# EAGLE design Trilife_1 (EAGLE 6.1)
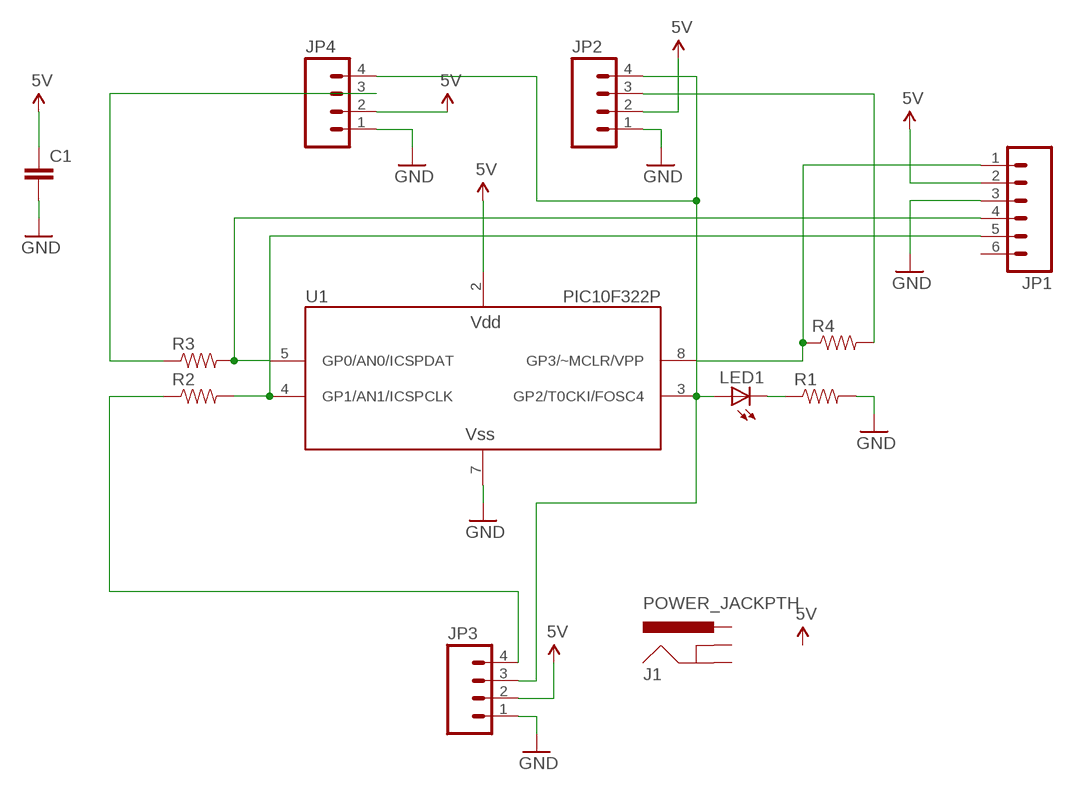
[diagram p0: schematic, sheet 1]

## Parts
C1  CAPPTH  [CAP-PTH-SMALL]
J1  POWER_JACKPTH  [POWER_JACK_PTH]
JP1  M06LOCK  [1X06_LOCK]
JP2  M04LOCK  [1X04_LOCK]
JP3  M04LOCK  [1X04_LOCK]
JP4  M04LOCK  [1X04_LOCK]
LED1  LED5MM  [LED5MM]
R1  RESISTORPTH-1/4W  [AXIAL-0.4]
R2  RESISTORPTH-1/4W  [AXIAL-0.4]
R3  RESISTORPTH-1/4W  [AXIAL-0.4]
R4  RESISTORPTH-1/4W  [AXIAL-0.4]
U1  PIC10F322P  [DIP-8]

## Nets
5V: C1.1 JP1.2 JP2.2 JP3.2 JP4.2 U1.2(VDD)
GND: C1.2 JP1.3 JP2.1 JP3.1 JP4.1 R1.P$2 U1.7(VSS)
N$1: JP2.4 JP3.3 JP4.4 LED1.A U1.3(GP2/T0CKI/FOSC4)
N$2: LED1.K(C) R1.P$1
N$3: JP1.1 R4.P$1 U1.8(GP3/~MCLR/VPP)
N$4: JP1.4 R3.P$2 U1.5(GP0/AN0/ICSPDAT)
N$5: JP1.5 R2.P$2 U1.4(GP1/AN1/ICSPCLK)
N$6: JP2.3 R4.P$2
N$8: JP4.3 R3.P$1
N$9: JP3.4 R2.P$1
Unconnected: J1.GND J1.GNDBREAK J1.PWR JP1.6

## Library data of the parts
C1 = SparkFun:CAP: Capacitor Standard 0603 ceramic capacitor, and 0.1" leaded capacitor.
J1 = SparkFun:POWER_JACK: Power Jack This is the standard 5.5mm barrel jack for power. The PTH is the most common, proven, reliable, footprint. All others are experimental. The Slot footprint only works if the mill layer is transmitted to the PCB fab house so be warned. Spark Fun Electronics SKU : PRT-00119. Mating wall wart : TOL-00298 (and others)
JP1 = SparkFun:M06: Header 6 Standard 6-pin 0.1" header. Use with straight break away headers (SKU : PRT-00116), right angle break away headers (PRT-00553), swiss pins (PRT-00743), machine pins (PRT-00117), and female headers (PRT-00115). Molex polarized connector foot print use with SKU : PRT-08094 with associated crimp pins and housings. NOTES ON THE VARIANTS LOCK and LOCK_LONGPADS... This footprint was designed to help hold the alignment of a through-hole component (i.e. 6-pin header) while soldering it into place. You may notice that each hole has been shifted either up or down by 0.005 of an inch from it's more standard position (which is a perfectly straight line). This slight alteration caused the pins (the squares in the middle) to touch the edges of the holes. Because they are alternating, it causes a "brace" to hold the component in place. 0.005 has proven to be the perfect amount of "off-center" position when using our standard breakaway headers. Although looks a little odd when you look at the bare footprint, once you have a header in there, the alteration is very hard to notice. Also, if you push a header all the way into place, it is covered up entirely on the bottom side. This idea of altering the position of holes to aid alignment will be further integrated into the Sparkfun Library for other footprints. It can help hold any component with 3 or more connection pins.
JP2-JP4 = SparkFun:M04: Header 4 Standard 4-pin 0.1" header. Use with straight break away headers (SKU : PRT-00116), right angle break away headers (PRT-00553), swiss pins (PRT-00743), machine pins (PRT-00117), and female headers (PRT-00115). Molex polarized connector foot print use with SKU : PRT-08231 with associated crimp pins and housings. 1MM SMD Version SKU: PRT-10208
LED1 = SparkFun:LED: LEDs Standard schematic elements and footprints for 5mm, 3mm, 1206, and 0603 sized LEDs. 5mm - Spark Fun Electronics SKU : COM-00529 (and others)
R1-R4 = SparkFun:RESISTOR: Resistor Basic schematic elements and footprints for 0603, 1206, and PTH resistors.
U1 = CindysStuff:PIC10F32*: Microchip PIC10F320 and 322 6-pin 8-bit Flash microcontroller 4 I/O, 2 8-bit timers, temperature sensor on PIC10F322

## Board
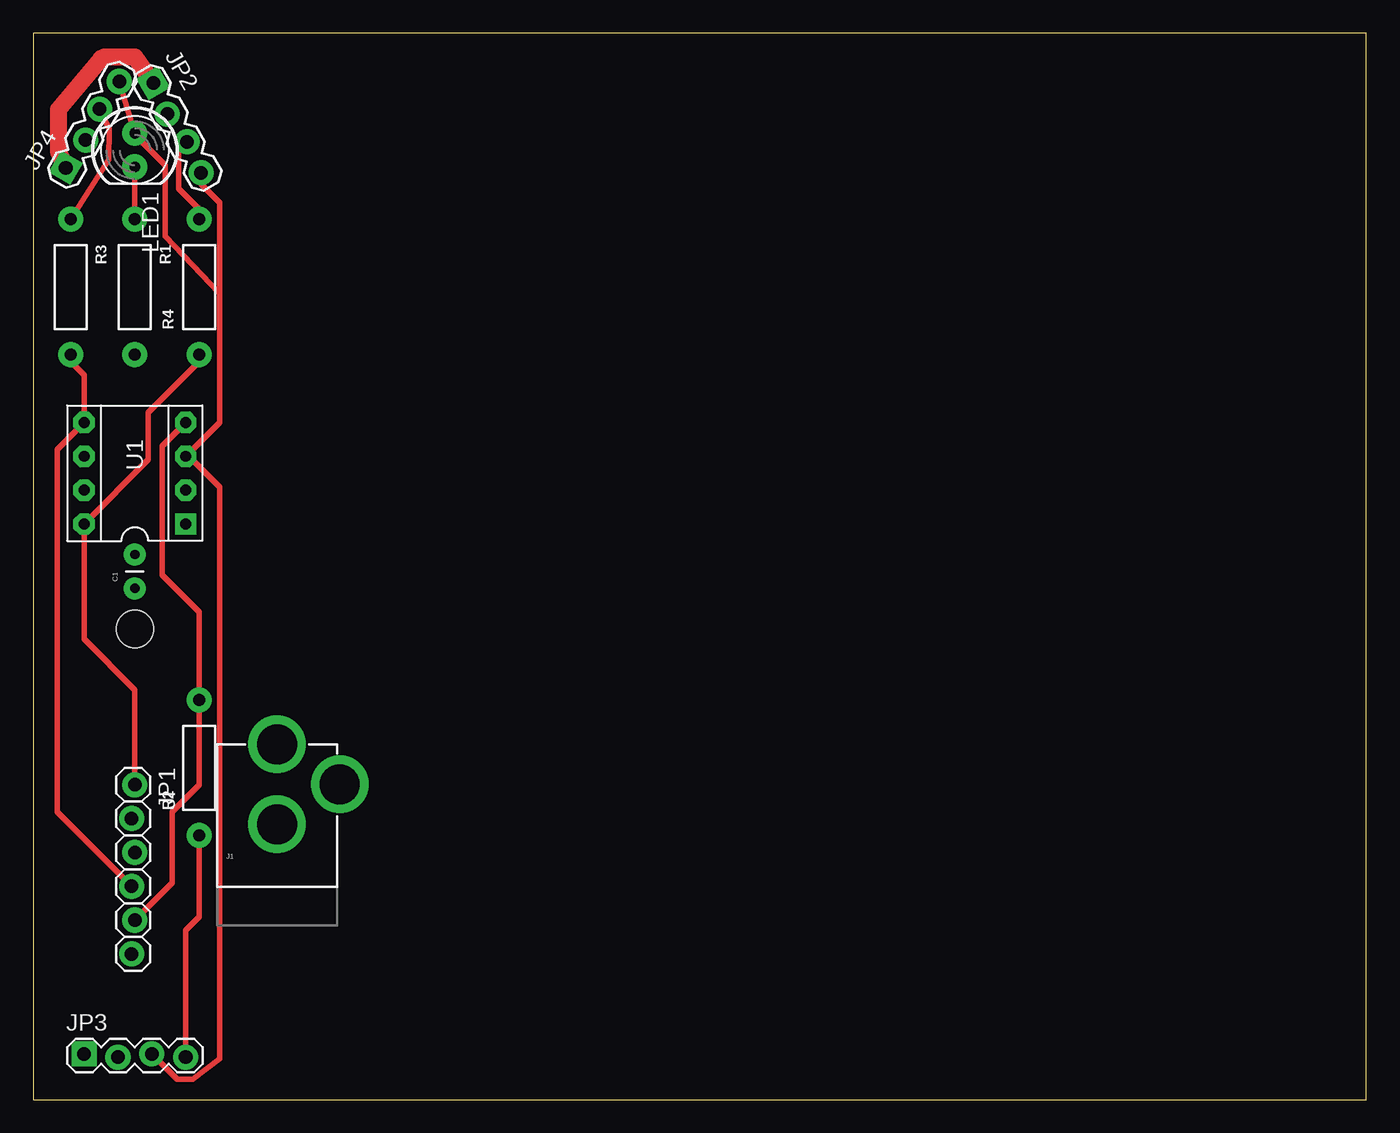
[diagram p1: board, top side]
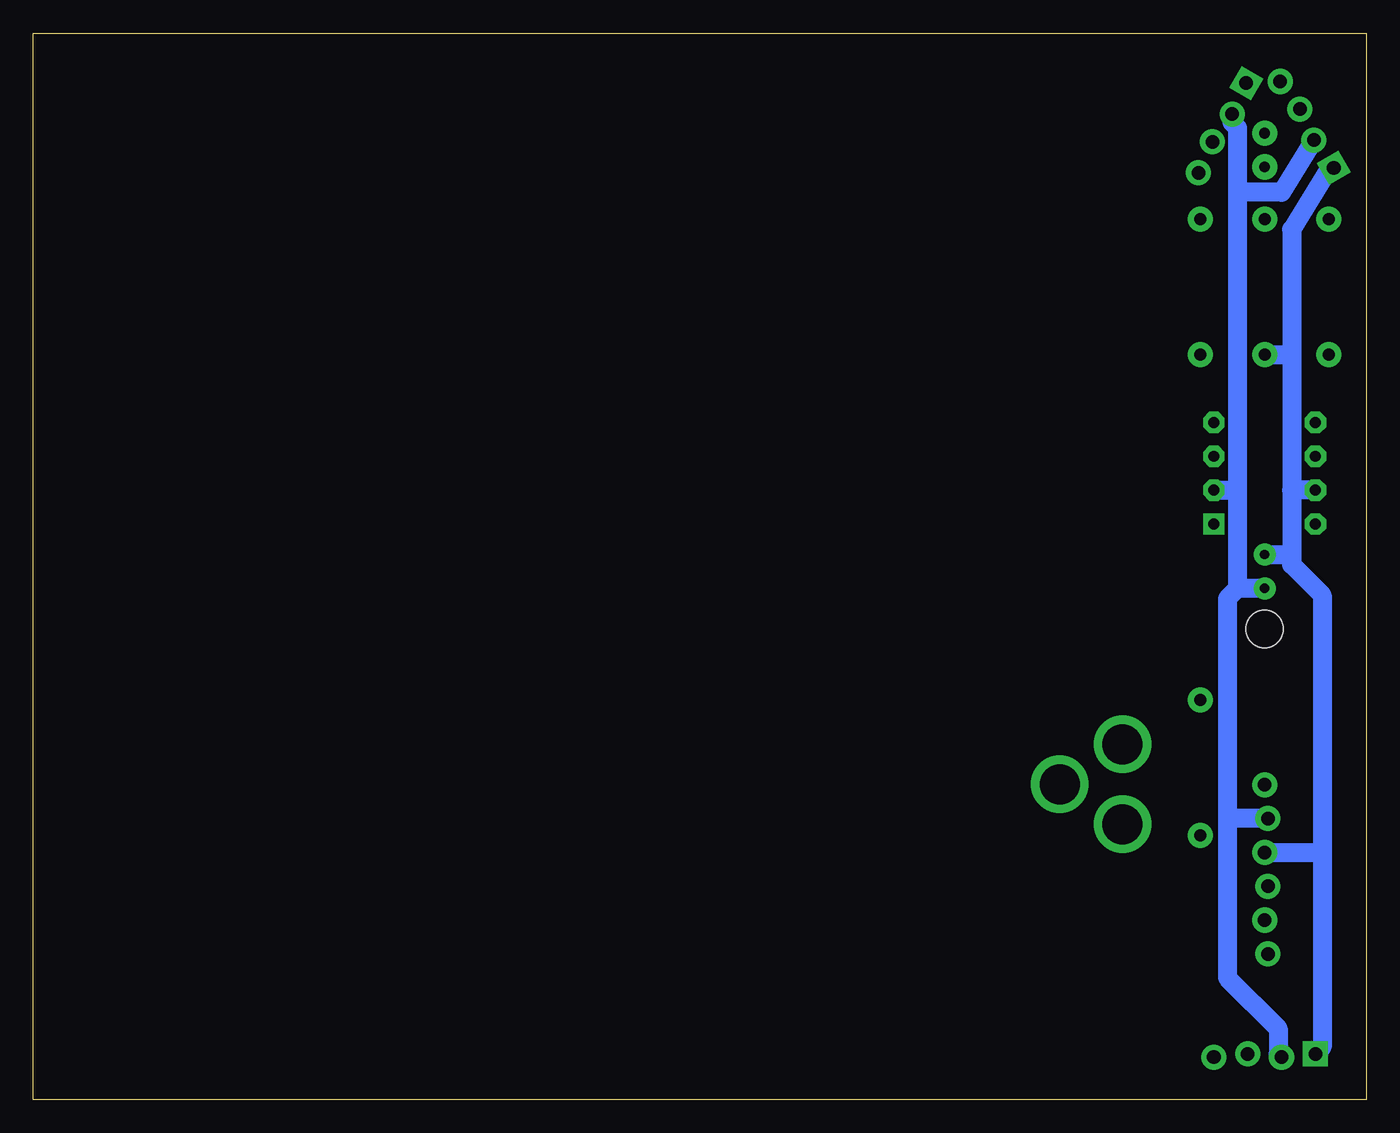
[diagram p2: board, bottom side, seen from below]

Size 100 x 80 mm. Coordinates in mm from the lower left corner, seen from the top.
Outline: 0,0 100,0 100,80 0,80 0,0
Copper layers (1*16): Top 0.035mm / dielectric 1.5mm / Bottom 0.035mm
Design rules: minimum track width 10mil, minimum drill 24mil, track to track 8mil, track to pad 8mil, pad to pad 8mil, via to via 8mil, smd to smd 8mil, copper to edge 40mil, drill to drill 8mil, minimum pad ring 10mil, minimum via ring 8mil, stop-mask expansion 4mil, vias tented up to drill 0mil, thermal gap 10mil
Holes 2.8 mm at 7.62,35.31

### Footprints (pad centres in the part's own frame; a part is rotated, then mirrored left to right if it is on the bottom)
CAP-PTH-SMALL = drill 0.7 pad 1.651: 1 0,0; 2 2.54,0
POWER_JACK_PTH = drill 2.997 pad 4.318: GND 0,7.7; GNDBREAK 4.7,10.7; PWR 0,13.7
1X06_LOCK = drill 1.016 pad 1.88: 1 0,0; 2 2.54,-0.254; 3 5.08,0; 4 7.62,-0.254; 5 10.16,0; 6 12.7,-0.254
1X04_LOCK = drill 1.016 pad 1.88 square: 1 0,0.127 | drill 1.016 pad 1.88: 2 2.54,-0.127; 3 5.08,0.127; 4 7.62,-0.127
LED5MM = drill 0.813 pad 1.88: A -1.27,0; K 1.27,0
AXIAL-0.4 = drill 0.9 pad 1.88: P$1 -5.08,0; P$2 5.08,0
DIP-8 = drill 0.813 pad 1.6 square: 1 -3.81,3.81 | drill 0.813 pad 1.6 octagon: 2 -3.81,1.27; 3 -3.81,-1.27; 4 -3.81,-3.81; 5 3.81,-3.81; 6 3.81,-1.27; 7 3.81,1.27; 8 3.81,3.81

### Placement (x,y rotation side)
C1  7.62,38.35 90 top
J1  18.29,12.95 0 top
JP1  7.62,23.62 270 top
JP2  8.89,76.2 300 top
JP3  3.81,3.3 0 top
JP4  2.54,69.85 60 top
LED1  7.62,71.25 270 top
R1  7.62,60.96 270 top
R2  12.45,24.89 90 top
R3  2.79,60.96 270 top
R4  12.45,60.96 90 top
U1  7.62,46.99 180 top

### Tracks (layer width: path | path; a pad name or v marks a point on that pad's centre or on a via)
5V
  Bottom 1.422: JP2.2 10.05,73.3 9.65,72.9 9.65,68.07 | 9.65,68.07 9.65,45.72 | 9.65,45.72 9.65,38.35 | JP4.2 6.35,68.07 9.65,68.07 | U1.2 9.65,45.72 | C1.1 9.65,38.35 | 9.65,38.35 10.41,37.59 10.41,21.08 | 10.41,21.08 10.41,9.14 6.6,5.33 6.6,3.43 JP3.2 | JP1.2 10.41,21.08
GND
  Top 1.27: JP4.1 1.91,71.12 1.91,74.3 5.08,78.11 5.33,78.23 7.62,78.23 JP2.1
  Bottom 1.422: JP4.1 2.73,69.91 5.59,65.28 5.59,55.88 | 5.59,55.88 5.59,45.72 | 5.59,45.72 5.59,40.89 | U1.7 5.59,45.72 | R1.P$2 5.59,55.88 | C1.2 5.59,40.89 | 5.59,40.89 5.59,40.13 3.3,37.85 3.3,18.54 | 3.3,18.54 3.3,3.94 JP3.1 | JP1.3 3.3,18.54
N$1
  Top 0.406: JP4.4 LED1.A 7.62,72.39 9.91,70.1 9.91,64.77 13.97,60.45 | JP2.4 12.59,68.69 13.97,67.31 13.97,60.45 | 13.97,60.45 13.97,50.8 U1.3 11.68,48.26 13.97,45.97 13.97,3.05 11.94,1.52 10.79,1.52 JP3.3
N$2
  Top 0.406: R1.P$1 LED1.K
N$3
  Top 0.406: R4.P$1 12.45,55.37 8.64,51.56 8.64,48.01 U1.8 3.81,34.54 7.62,30.73 JP1.1
N$4
  Top 0.406: JP1.4 1.78,21.59 1.78,48.77 U1.5 4.06,50.8 3.81,51.05 3.81,54.36 2.79,55.37 R3.P$2
N$5
  Top 0.406: U1.4 9.65,49.02 9.65,39.37 12.45,36.58 R2.P$2 12.45,23.62 10.41,21.59 10.41,16.26 JP1.5
N$6
  Top 0.406: R4.P$2 12.45,66.8 10.92,68.33 10.92,71.25 JP2.3
N$8
  Top 0.406: R3.P$1 5.66,70.51 5.69,72.8 JP4.3
N$9
  Top 0.406: JP3.4 11.43,12.7 12.45,13.72 R2.P$1